# Altium schematic sheet BLE-HM10.SchDoc
size A4
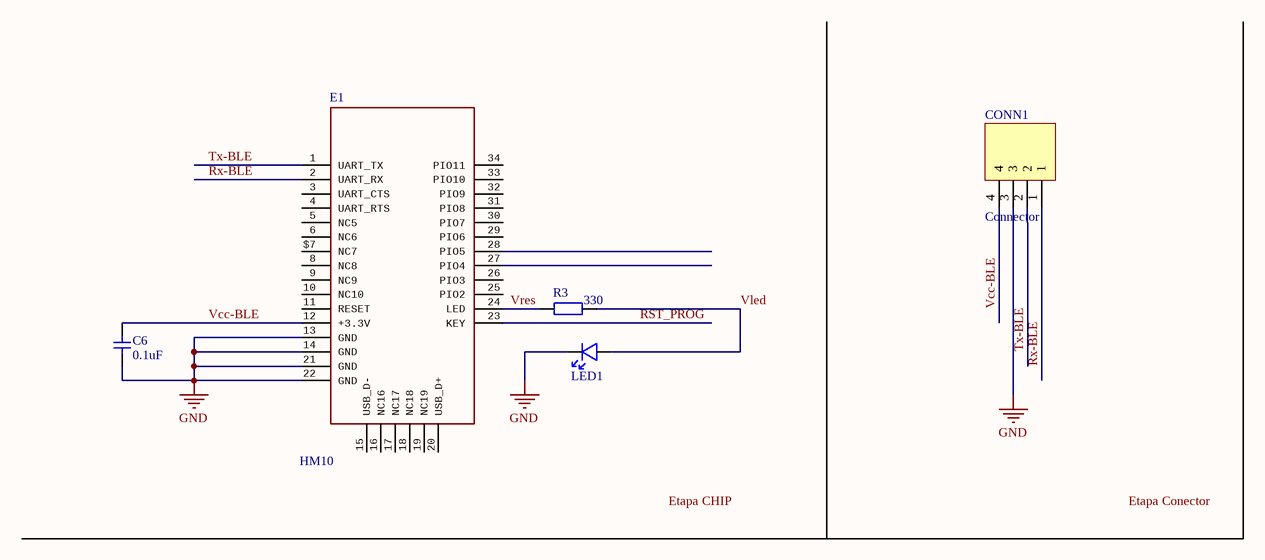
[diagram p0: BLE-HM10.SchDoc]

## Parts
C6  value 0.1uF  [C1206-1.25]  (hidden comment: C2)
CONN1  Connector  [1x4x2.54 Pin Header TH V]
E1  value HM10  [26.9X13X2.2_BOARD]  (hidden comment: HM Bluetooth module use TI CC2540 or CC2541, Master and slave roles in one, transmission version and remote control version and PIO state acquisition functions in one, Support the AT command modify module parameters, Convenient and flexible.)
LED1  LED  [SMT1206-LED]  (value not drawn)
R3  value 330  [R1206-0.55]  (hidden comment: R)

## Nets
GND: C6.1 CONN1.3 E1.13(GND) E1.14(GND) E1.21(GND) E1.22(GND) LED1.2
RST_PROG: E1.23(KEY)
Rx-BLE: CONN1.1 E1.2(UART_RX)
Tx-BLE: CONN1.2 E1.1(UART_TX)
Vcc-BLE: C6.2 CONN1.4 E1.12(+3.3V)
Vled: LED1.1 R3.2
Vres: E1.24(LED) R3.1

Not connected (* = marked no-connect by the designer): E1 3(UART_CTS) 4(UART_RTS) 5(NC5) 6(NC6) 8(NC8) 9(NC9) 10(NC10) 11(RESET) 15(USB_D-) 16(NC16) 17(NC17) 18(NC18) 19(NC19) 20(USB_D+) 25(PIO2) 26(PIO3) 27(PIO4) 28(PIO5) 29(PIO6) 30(PIO7) 31(PIO8) 32(PIO9) 33(PIO10) 34(PIO11) $7(NC7)

## Notes on the sheet
- Labels drawn without touching a wire or pin: Etapa CHIP, Etapa Conector

## Library data of the parts
C6 = C: Capacitor, generic
CONN1 = Header 1x4: Header
E1 = HM-10-BOARD: HM10 BLE
LED1 = LED: *
R3 = R: Resistor, generic